# Altium schematic sheet Slave4.SchDoc
size A4; SheetNumber: 7; SheetTotal: 7
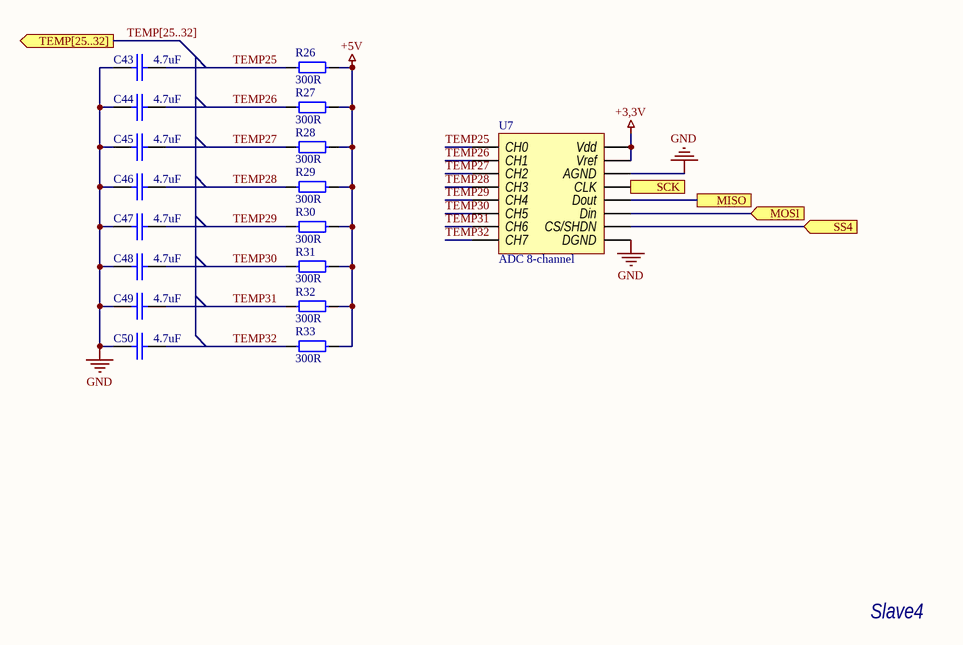
[diagram p0: Slave4.SchDoc]

## Parts
C43  4.7uF  [0603 Capicator]
C44  4.7uF  [0603 Capicator]
C45  4.7uF  [0603 Capicator]
C46  4.7uF  [0603 Capicator]
C47  4.7uF  [0603 Capicator]
C48  4.7uF  [0603 Capicator]
C49  4.7uF  [0603 Capicator]
C50  4.7uF  [0603 Capicator]
R26  300R  [0603 Resistor]
R27  300R  [0603 Resistor]
R28  300R  [0603 Resistor]
R29  300R  [0603 Resistor]
R30  300R  [0603 Resistor]
R31  300R  [0603 Resistor]
R32  300R  [0603 Resistor]
R33  300R  [0603 Resistor]
U7  ADC 8-channel  [SOIC-16]

## Ports
MISO, MOSI (in), SCK, SS4 (in), TEMP[25..32] (out)

## Nets
+3,3V: U7.15(Vref) U7.16(Vdd)
+5V: R26.2 R27.2 R28.2 R29.2 R30.2 R31.2 R32.2 R33.2
GND: C43.1 C44.1 C45.1 C46.1 C47.1 C48.1 C49.1 C50.1 U7.9(DGND) U7.14(AGND)
MISO: U7.12(Dout) ; port MISO
MOSI: U7.11(Din) ; port MOSI
SCK: U7.13(CLK) ; port SCK
SS4: U7.10(CS/SHDN) ; port SS4
TEMP25: C43.2 R26.1 U7.1(CH0)
TEMP26: C44.2 R27.1 U7.2(CH1)
TEMP27: C45.2 R28.1 U7.3(CH2)
TEMP28: C46.2 R29.1 U7.4(CH3)
TEMP29: C47.2 R30.1 U7.5(CH4)
TEMP30: C48.2 R31.1 U7.6(CH5)
TEMP31: C49.2 R32.1 U7.7(CH6)
TEMP32: C50.2 R33.1 U7.8(CH7)

## Buses and harness runs
bus TEMP[25..32] = port TEMP[25..32]

## Notes on the sheet
- Slave4

## Library data of the parts
C43-C50 = Cap 4.7uF (0603): 4.7uF X5R 25V 10% 0603; Manufacturer: Murata Manufacturing; Part Number: GRM188R61E475KE11D; Type: Capacitor; ComponentLink1Description: Chip&Dip; ComponentLink1URL: https://www.chipdip.ru/product0/9000348448
R26-R33 = Res 300R (0603): 0.1W 0603 300R, 1%; Part Number: RC0603FR-07360RL; Manufacturer: Taiwan; Type: Resistor; ComponentLink1Description: Chip&Dip; ComponentLink1URL: https://www.chipdip.ru/product0/9000079629
U7 = MCP3008-I/SL: A/D converter with SPI serial interface; Manufacturer: Microchip; Part Number: MCP3008-I/SL; Type: IC; ComponentLink1Description: ChipDip; ComponentLink1URL: https://www.chipdip.ru/product/mcp3008-i-sl; ComponentLink2Description: Datadheet; ComponentLink2URL: https://static.chipdip.ru/lib/527/DOC011527685.pdf